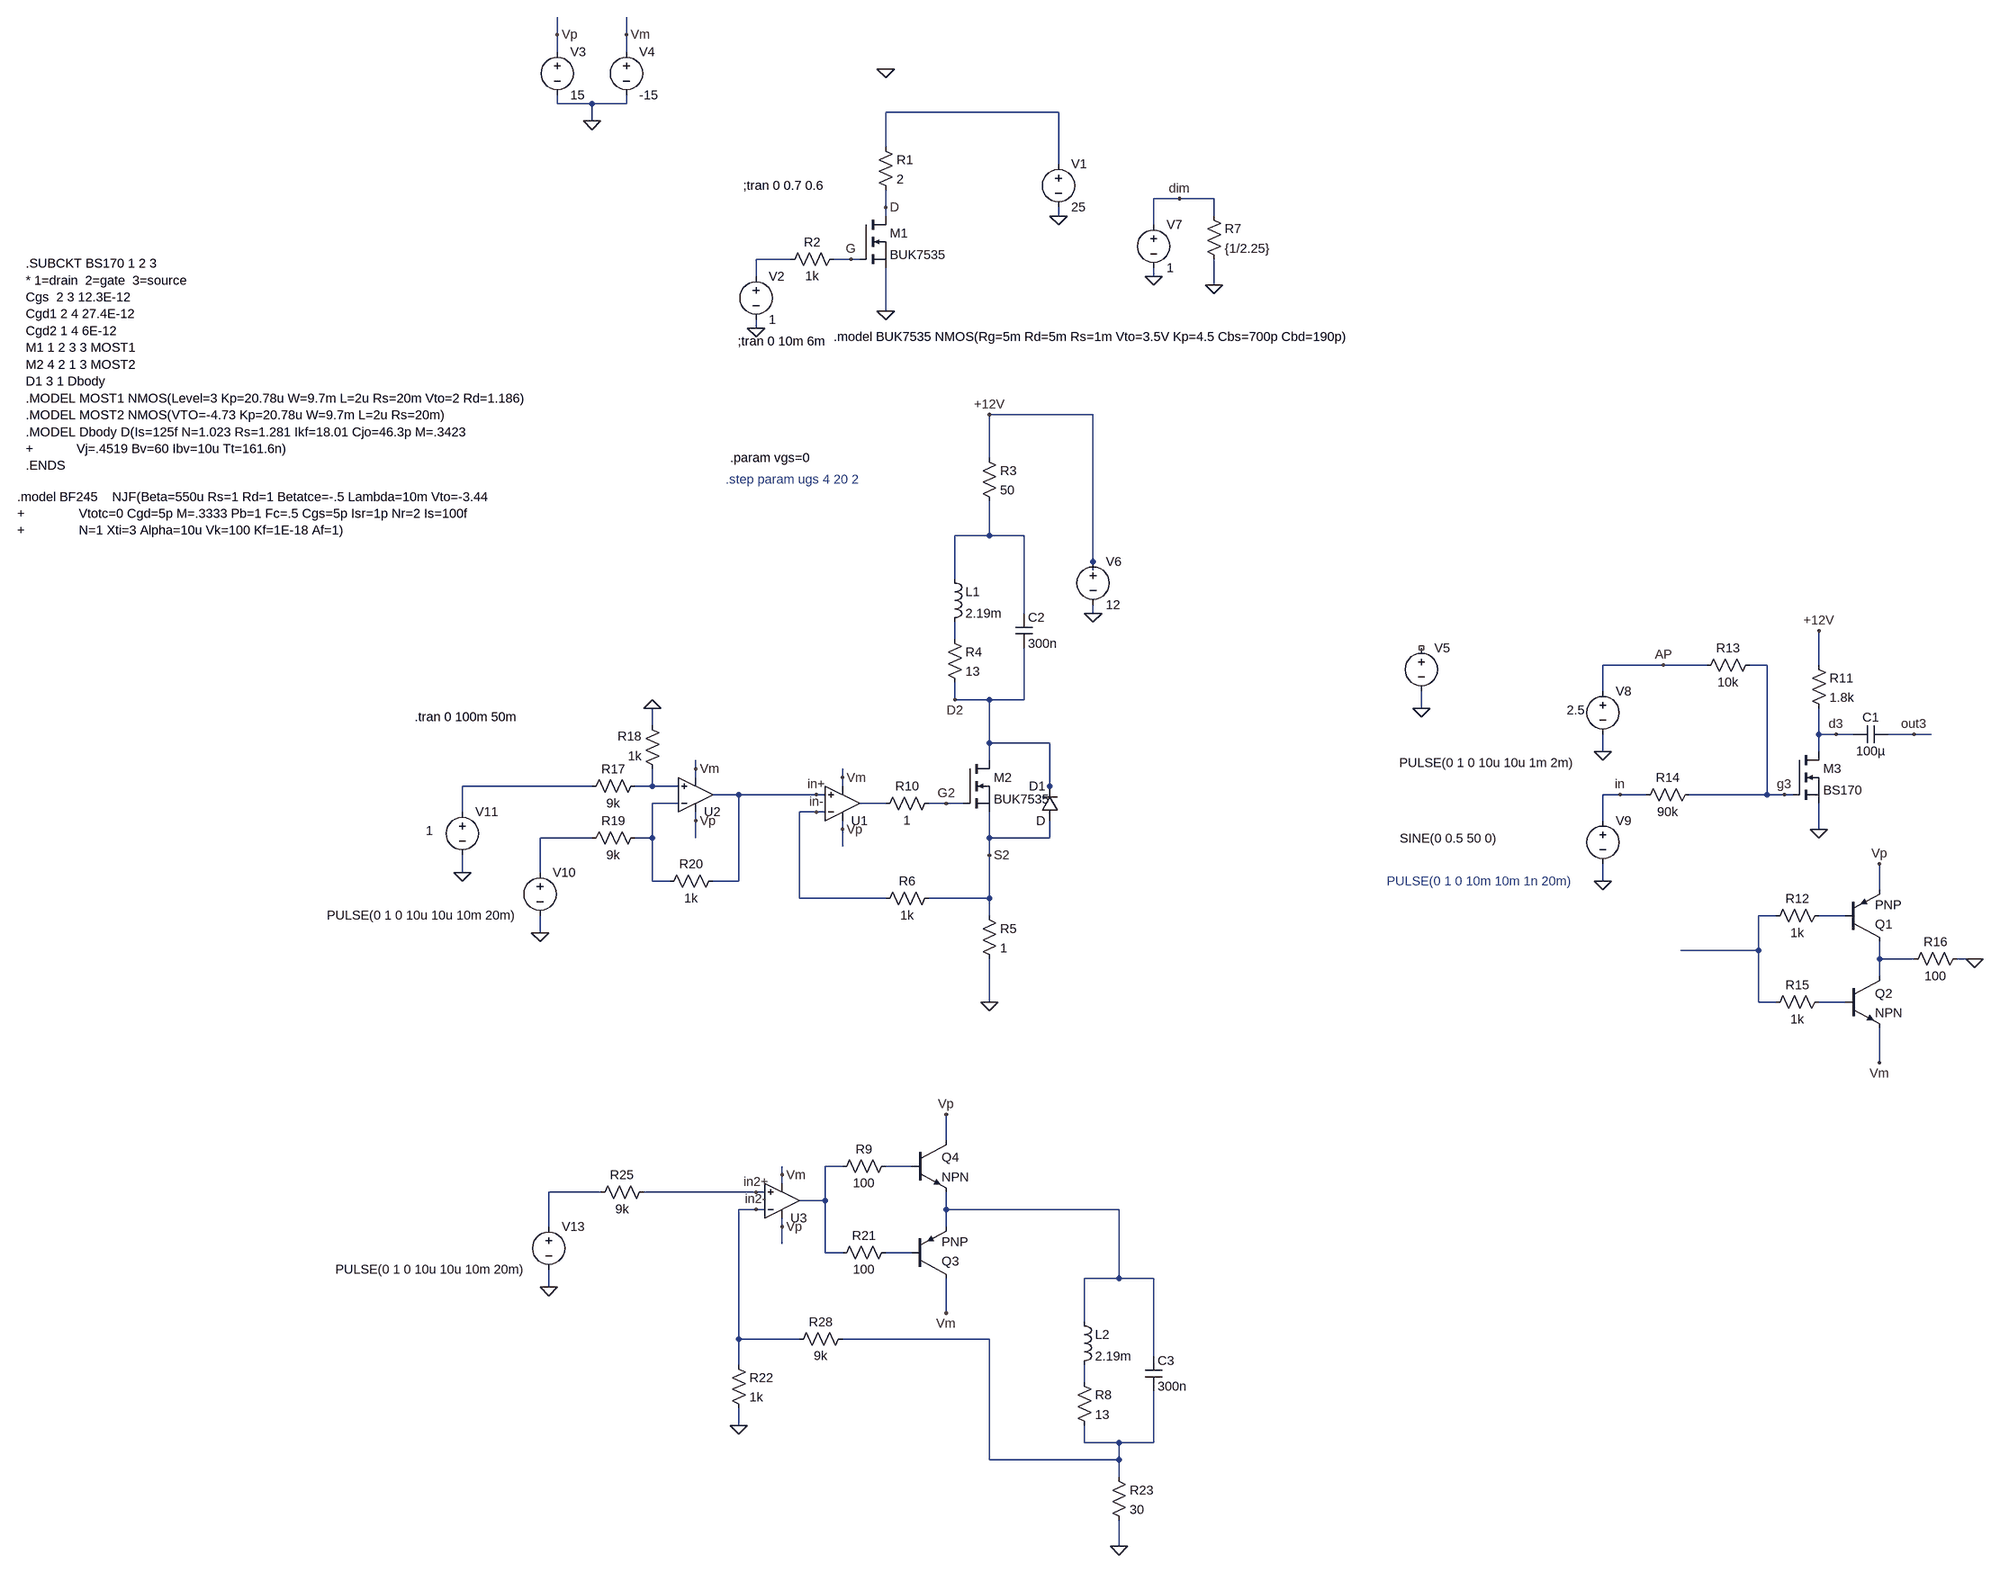
[diagram p0: schematic BUK7535_model.asc]
BUK7535_model.asc, the LTspice schematic file:
Version 4
SHEET 1 2148 2868
WIRE -496 -560 -496 -592
WIRE -368 -560 -368 -592
WIRE -496 -528 -496 -560
WIRE -368 -528 -368 -560
WIRE -496 -432 -496 -448
WIRE -432 -432 -496 -432
WIRE -368 -432 -368 -448
WIRE -368 -432 -432 -432
WIRE 432 -416 112 -416
WIRE -432 -400 -432 -432
WIRE 112 -352 112 -416
WIRE 432 -320 432 -416
WIRE 656 -256 608 -256
WIRE 720 -256 656 -256
WIRE 112 -240 112 -272
WIRE 112 -224 112 -240
WIRE 432 -224 432 -240
WIRE 720 -224 720 -256
WIRE 608 -208 608 -256
WIRE -64 -144 -128 -144
WIRE 48 -144 16 -144
WIRE 64 -144 48 -144
WIRE -128 -112 -128 -144
WIRE 608 -112 608 -128
WIRE 720 -96 720 -144
WIRE 112 -48 112 -128
WIRE -128 -16 -128 -32
WIRE 496 144 304 144
WIRE 304 224 304 144
WIRE 304 368 304 304
WIRE 304 368 240 368
WIRE 368 368 304 368
WIRE 496 416 496 144
WIRE 496 432 496 416
WIRE 240 448 240 368
WIRE 368 512 368 368
WIRE 496 512 496 496
WIRE 240 560 240 528
WIRE 1552 608 1440 608
WIRE 1632 608 1552 608
WIRE 1744 608 1712 608
WIRE 1840 608 1840 544
WIRE 1440 656 1440 608
WIRE 240 672 240 640
WIRE 304 672 240 672
WIRE 368 672 368 576
WIRE 368 672 304 672
WIRE 1104 688 1104 656
WIRE -320 720 -320 688
WIRE 1840 736 1840 688
WIRE 1872 736 1840 736
WIRE 1904 736 1872 736
WIRE 2016 736 1968 736
WIRE 2048 736 2016 736
WIRE 304 752 304 672
WIRE 416 752 304 752
WIRE 1440 768 1440 736
WIRE 1840 768 1840 736
WIRE 304 784 304 752
WIRE -240 800 -240 784
WIRE -240 816 -240 800
WIRE 32 816 32 800
WIRE -432 832 -672 832
WIRE -320 832 -320 800
WIRE -320 832 -352 832
WIRE -272 832 -320 832
WIRE 32 832 32 816
WIRE 416 832 416 752
WIRE -160 848 -208 848
WIRE -16 848 -160 848
WIRE 0 848 -16 848
WIRE 416 848 416 832
WIRE 1472 848 1440 848
WIRE 1520 848 1472 848
WIRE 1744 848 1744 608
WIRE 1744 848 1600 848
WIRE 1776 848 1744 848
WIRE 1792 848 1776 848
WIRE -272 864 -320 864
WIRE 112 864 64 864
WIRE 224 864 192 864
WIRE 256 864 224 864
WIRE -672 880 -672 832
WIRE -16 880 -48 880
WIRE 0 880 -16 880
WIRE -240 896 -240 880
WIRE 1440 896 1440 848
WIRE 32 912 32 896
WIRE 1840 912 1840 864
WIRE -432 928 -528 928
WIRE -320 928 -320 864
WIRE -320 928 -352 928
WIRE -240 928 -240 896
WIRE 304 928 304 880
WIRE 416 928 416 896
WIRE 416 928 304 928
WIRE 32 944 32 912
WIRE 304 960 304 928
WIRE -672 992 -672 960
WIRE -528 992 -528 928
WIRE -320 1008 -320 928
WIRE -288 1008 -320 1008
WIRE -160 1008 -160 848
WIRE -160 1008 -208 1008
WIRE 1440 1008 1440 976
WIRE 1952 1024 1952 976
WIRE -48 1040 -48 880
WIRE 112 1040 -48 1040
WIRE 304 1040 304 960
WIRE 304 1040 192 1040
WIRE 304 1072 304 1040
WIRE 1760 1072 1728 1072
WIRE 1888 1072 1840 1072
WIRE -528 1104 -528 1072
WIRE 1728 1136 1728 1072
WIRE 1728 1136 1584 1136
WIRE 1952 1152 1952 1120
WIRE 2016 1152 1952 1152
WIRE 2128 1152 2096 1152
WIRE 2144 1152 2128 1152
WIRE 1952 1184 1952 1152
WIRE 304 1232 304 1152
WIRE 1728 1232 1728 1136
WIRE 1760 1232 1728 1232
WIRE 1888 1232 1840 1232
WIRE 1952 1344 1952 1280
WIRE 224 1488 224 1440
WIRE 32 1536 0 1536
WIRE 160 1536 112 1536
WIRE -80 1552 -80 1536
WIRE -80 1568 -80 1552
WIRE -416 1584 -512 1584
WIRE -128 1584 -336 1584
WIRE -112 1584 -128 1584
WIRE 0 1600 0 1536
WIRE 0 1600 -48 1600
WIRE -128 1616 -160 1616
WIRE -112 1616 -128 1616
WIRE 224 1616 224 1584
WIRE 544 1616 224 1616
WIRE -512 1648 -512 1584
WIRE -80 1648 -80 1632
WIRE 224 1648 224 1616
WIRE -80 1680 -80 1648
WIRE 0 1696 0 1600
WIRE 32 1696 0 1696
WIRE 160 1696 112 1696
WIRE 544 1744 544 1616
WIRE 544 1744 480 1744
WIRE 608 1744 544 1744
WIRE -512 1760 -512 1728
WIRE 224 1808 224 1744
WIRE 480 1824 480 1744
WIRE -160 1856 -160 1616
WIRE -48 1856 -160 1856
WIRE 304 1856 32 1856
WIRE 608 1888 608 1744
WIRE -160 1904 -160 1856
WIRE 480 1936 480 1904
WIRE -160 2016 -160 1984
WIRE 480 2048 480 2016
WIRE 544 2048 480 2048
WIRE 608 2048 608 1952
WIRE 608 2048 544 2048
WIRE 304 2080 304 1856
WIRE 544 2080 544 2048
WIRE 544 2080 304 2080
WIRE 544 2112 544 2080
WIRE 544 2240 544 2192
FLAG 432 -224 0
FLAG 112 -48 0
FLAG -128 -16 0
FLAG 112 -240 D
FLAG 112 -496 0
FLAG -432 -400 0
FLAG -496 -560 Vp
FLAG -368 -560 Vm
FLAG 1104 688 0
FLAG 304 1232 0
FLAG 240 672 D2
FLAG 496 512 0
FLAG 32 912 Vp
FLAG 32 816 Vm
FLAG 48 -144 G
FLAG 608 -112 0
FLAG 720 -96 0
FLAG 656 -256 dim
FLAG 224 864 G2
FLAG 304 960 S2
FLAG -16 848 in+
FLAG -16 880 in-
FLAG 1840 912 0
FLAG 1440 768 0
FLAG 1440 1008 0
FLAG 1776 848 g3
FLAG 1872 736 d3
FLAG 2016 736 out3
FLAG 304 144 +12V
FLAG 1840 544 +12V
FLAG 1552 608 AP
FLAG 1472 848 in
FLAG 2128 1152 0
FLAG 1952 976 Vp
FLAG 1952 1344 Vm
FLAG -528 1104 0
FLAG -240 896 Vp
FLAG -240 800 Vm
FLAG -320 688 0
FLAG -672 992 0
FLAG -80 1648 Vp
FLAG -80 1552 Vm
FLAG -128 1584 in2+
FLAG -128 1616 in2-
FLAG -512 1760 0
FLAG 224 1440 Vp
FLAG 224 1808 Vm
FLAG 544 2240 0
FLAG -160 2016 0
SYMBOL nmos 64 -224 R0
SYMATTR InstName M1
SYMATTR Value BUK7535
SYMBOL res 96 -368 R0
SYMATTR InstName R1
SYMATTR Value 2
SYMBOL voltage 432 -336 R0
WINDOW 123 0 0 Left 2
WINDOW 39 0 0 Left 2
SYMATTR InstName V1
SYMATTR Value 25
SYMBOL res 32 -160 R90
WINDOW 0 0 56 VBottom 2
WINDOW 3 32 56 VTop 2
SYMATTR InstName R2
SYMATTR Value 1k
SYMBOL voltage -128 -128 R0
WINDOW 123 0 0 Left 2
WINDOW 39 0 0 Left 2
SYMATTR InstName V2
SYMATTR Value 1
SYMBOL voltage -496 -544 R0
WINDOW 123 0 0 Left 2
WINDOW 39 0 0 Left 2
SYMATTR InstName V3
SYMATTR Value 15
SYMBOL voltage -368 -544 R0
WINDOW 123 0 0 Left 2
WINDOW 39 0 0 Left 2
SYMATTR InstName V4
SYMATTR Value -15
SYMBOL voltage 1104 560 R0
WINDOW 3 -41 229 Left 2
WINDOW 123 0 0 Left 2
WINDOW 39 0 0 Left 2
SYMATTR InstName V5
SYMATTR Value PULSE(0 1 0 10u 10u 1m 2m)
SYMBOL nmos 256 784 R0
SYMATTR InstName M2
SYMATTR Value BUK7535
SYMBOL res 224 544 R0
SYMATTR InstName R4
SYMATTR Value 13
SYMBOL voltage 496 400 R0
WINDOW 123 0 0 Left 2
WINDOW 39 0 0 Left 2
SYMATTR InstName V6
SYMATTR Value 12
SYMBOL ind 224 432 R0
SYMATTR InstName L1
SYMATTR Value 2.19m
SYMBOL diode 432 896 R180
WINDOW 0 24 64 Left 2
WINDOW 3 24 0 Left 2
SYMATTR InstName D1
SYMBOL cap 352 512 R0
SYMATTR InstName C2
SYMATTR Value 300n
SYMBOL res 288 1056 R0
SYMATTR InstName R5
SYMATTR Value 1
SYMBOL res 208 1024 R90
WINDOW 0 0 56 VBottom 2
WINDOW 3 32 56 VTop 2
SYMATTR InstName R6
SYMATTR Value 1k
SYMBOL Opamps\\UniversalOpamp2 32 864 M180
SYMATTR InstName U1
SYMBOL voltage 608 -224 R0
WINDOW 123 0 0 Left 2
WINDOW 39 0 0 Left 2
SYMATTR InstName V7
SYMATTR Value 1
SYMBOL res 704 -240 R0
SYMATTR InstName R7
SYMATTR Value {1/2.25}
SYMBOL res 208 848 R90
WINDOW 0 0 56 VBottom 2
WINDOW 3 32 56 VTop 2
SYMATTR InstName R10
SYMATTR Value 1
SYMBOL nmos 1792 768 R0
SYMATTR InstName M3
SYMATTR Value BS170
SYMATTR Prefix x
SYMBOL res 1824 592 R0
SYMATTR InstName R11
SYMATTR Value 1.8k
SYMBOL res 1728 592 R90
WINDOW 0 0 56 VBottom 2
WINDOW 3 32 56 VTop 2
SYMATTR InstName R13
SYMATTR Value 10k
SYMBOL res 1616 832 R90
WINDOW 0 0 56 VBottom 2
WINDOW 3 32 56 VTop 2
SYMATTR InstName R14
SYMATTR Value 90k
SYMBOL voltage 1440 640 R0
WINDOW 3 -67 51 Left 2
WINDOW 123 0 0 Left 2
WINDOW 39 0 0 Left 2
SYMATTR InstName V8
SYMATTR Value 2.5
SYMBOL voltage 1440 880 R0
WINDOW 3 -376 49 Left 2
WINDOW 123 0 0 Left 2
WINDOW 39 0 0 Left 2
SYMATTR InstName V9
SYMATTR Value SINE(0 0.5 50 0)
SYMBOL cap 1968 720 R90
WINDOW 0 0 32 VBottom 2
WINDOW 3 32 32 VTop 2
SYMATTR InstName C1
SYMATTR Value 100µ
SYMBOL pnp 1888 1120 M180
SYMATTR InstName Q1
SYMBOL npn 1888 1184 R0
SYMATTR InstName Q2
SYMBOL res 1856 1056 R90
WINDOW 0 0 56 VBottom 2
WINDOW 3 32 56 VTop 2
SYMATTR InstName R12
SYMATTR Value 1k
SYMBOL res 1856 1216 R90
WINDOW 0 0 56 VBottom 2
WINDOW 3 32 56 VTop 2
SYMATTR InstName R15
SYMATTR Value 1k
SYMBOL res 2112 1136 R90
WINDOW 0 0 56 VBottom 2
WINDOW 3 32 56 VTop 2
SYMATTR InstName R16
SYMATTR Value 100
SYMBOL voltage -528 976 R0
WINDOW 3 -395 95 Left 2
WINDOW 123 0 0 Left 2
WINDOW 39 0 0 Left 2
SYMATTR InstName V10
SYMATTR Value PULSE(0 1 0 10u 10u 10m 20m)
SYMBOL Opamps\\UniversalOpamp2 -240 848 M180
SYMATTR InstName U2
SYMBOL res -336 816 R90
WINDOW 0 0 56 VBottom 2
WINDOW 3 32 56 VTop 2
SYMATTR InstName R17
SYMATTR Value 9k
SYMBOL res -304 816 R180
WINDOW 0 36 76 Left 2
WINDOW 3 36 40 Left 2
SYMATTR InstName R18
SYMATTR Value 1k
SYMBOL res -448 944 R270
WINDOW 0 32 56 VTop 2
WINDOW 3 0 56 VBottom 2
SYMATTR InstName R19
SYMATTR Value 9k
SYMBOL res -304 1024 R270
WINDOW 0 32 56 VTop 2
WINDOW 3 0 56 VBottom 2
SYMATTR InstName R20
SYMATTR Value 1k
SYMBOL voltage -672 864 R0
WINDOW 3 -67 51 Left 2
WINDOW 123 0 0 Left 2
WINDOW 39 0 0 Left 2
SYMATTR InstName V11
SYMATTR Value 1
SYMBOL res 288 208 R0
SYMATTR InstName R3
SYMATTR Value 50
SYMBOL res 464 1920 R0
SYMATTR InstName R8
SYMATTR Value 13
SYMBOL ind 464 1808 R0
SYMATTR InstName L2
SYMATTR Value 2.19m
SYMBOL cap 592 1888 R0
SYMATTR InstName C3
SYMATTR Value 300n
SYMBOL Opamps\\UniversalOpamp2 -80 1600 M180
SYMATTR InstName U3
SYMBOL voltage -512 1632 R0
WINDOW 3 -395 95 Left 2
WINDOW 123 0 0 Left 2
WINDOW 39 0 0 Left 2
SYMATTR InstName V13
SYMATTR Value PULSE(0 1 0 10u 10u 10m 20m)
SYMBOL res -432 1600 R270
WINDOW 0 32 56 VTop 2
WINDOW 3 0 56 VBottom 2
SYMATTR InstName R25
SYMATTR Value 9k
SYMBOL pnp 160 1744 M180
SYMATTR InstName Q3
SYMBOL npn 160 1488 R0
SYMATTR InstName Q4
SYMBOL res 128 1520 R90
WINDOW 0 0 56 VBottom 2
WINDOW 3 32 56 VTop 2
SYMATTR InstName R9
SYMATTR Value 100
SYMBOL res 128 1680 R90
WINDOW 0 0 56 VBottom 2
WINDOW 3 32 56 VTop 2
SYMATTR InstName R21
SYMATTR Value 100
SYMBOL res -176 1888 R0
SYMATTR InstName R22
SYMATTR Value 1k
SYMBOL res 48 1840 R90
WINDOW 0 0 56 VBottom 2
WINDOW 3 32 56 VTop 2
SYMATTR InstName R28
SYMATTR Value 9k
SYMBOL res 528 2096 R0
SYMATTR InstName R23
SYMATTR Value 30
TEXT -162 8 Left 2 !;tran 0 10m 6m
TEXT 16 0 Left 2 !.model BUK7535 NMOS(Rg=5m Rd=5m Rs=1m Vto=3.5V Kp=4.5 Cbs=700p Cbd=190p)
TEXT -152 -280 Left 2 !;tran 0 0.7 0.6
TEXT -176 224 Left 2 !.param vgs=0
TEXT -184 264 Left 2 ;.step param ugs 4 20 2
TEXT -1480 -136 Left 2 !.SUBCKT BS170 1 2 3\n* 1=drain  2=gate  3=source\nCgs  2 3 12.3E-12\nCgd1 2 4 27.4E-12\nCgd2 1 4 6E-12\nM1 1 2 3 3 MOST1\nM2 4 2 1 3 MOST2\nD1 3 1 Dbody\n.MODEL MOST1 NMOS(Level=3 Kp=20.78u W=9.7m L=2u Rs=20m Vto=2 Rd=1.186)\n.MODEL MOST2 NMOS(VTO=-4.73 Kp=20.78u W=9.7m L=2u Rs=20m)\n.MODEL Dbody D(Is=125f N=1.023 Rs=1.281 Ikf=18.01 Cjo=46.3p M=.3423\n+            Vj=.4519 Bv=60 Ibv=10u Tt=161.6n)\n.ENDS
TEXT -1496 296 Left 2 !.model BF245    NJF(Beta=550u Rs=1 Rd=1 Betatce=-.5 Lambda=10m Vto=-3.44\n+               Vtotc=0 Cgd=5p M=.3333 Pb=1 Fc=.5 Cgs=5p Isr=1p Nr=2 Is=100f\n+               N=1 Xti=3 Alpha=10u Vk=100 Kf=1E-18 Af=1)
TEXT 1040 1008 Left 2 ;PULSE(0 1 0 10m 10m 1n 20m)
TEXT -760 704 Left 2 !.tran 0 100m 50m

The netlist it stands for:
* BUK7535_model.asc
M1 D G 0 0 BUK7535
R1 N001 D 2
V1 N001 0 25
R2 G N002 1k
V2 N002 0 1
V3 Vp 0 15
V4 Vm 0 -15
V5 NC_01 0 PULSE(0 1 0 10u 10u 1m 2m)
M2 D2 G2 S2 S2 BUK7535
R4 N004 D2 13
V6 +12V 0 12
L1 N003 N004 2.19m
D1 S2 D2 D
C2 N003 D2 300n
R5 S2 0 1
R6 S2 in- 1k
XU1 in+ in- Vp Vm N008 level.2 Avol=1Meg GBW=10Meg Slew=10Meg ilimit=25m rail=0 Vos=0 phimargin=45 en=0 enk=0 in=0 ink=0 Rin=500Meg  ; pins IN+ IN- V+ V- OUT
V7 dim 0 1
R7 dim 0 {1/2.25}
R10 G2 N008 1
XM3 d3 g3 0 BS170  ; pins D G S
R11 +12V d3 1.8k
R13 g3 AP 10k
R14 g3 in 90k
V8 AP 0 2.5
V9 in 0 SINE(0 0.5 50 0)
C1 out3 d3 100µ
Q1 N012 N011 Vp 0 PNP
Q2 N012 N013 Vm 0 NPN
R12 N011 N010 1k
R15 N013 N010 1k
R16 0 N012 100
V10 N009 0 PULSE(0 1 0 10u 10u 10m 20m)
XU2 N006 N007 Vp Vm in+ level.2 Avol=1Meg GBW=10Meg Slew=10Meg ilimit=25m rail=0 Vos=0 phimargin=45 en=0 enk=0 in=0 ink=0 Rin=500Meg  ; pins IN+ IN- V+ V- OUT
R17 N006 N005 9k
R18 N006 0 1k
R19 N009 N007 9k
R20 N007 in+ 1k
V11 N005 0 1
R3 +12V N003 50
R8 N020 N019 13
L2 N017 N020 2.19m
C3 N017 N019 300n
XU3 in2+ in2- Vp Vm N014 level.2 Avol=1Meg GBW=10Meg Slew=10Meg ilimit=25m rail=0 Vos=0 phimargin=45 en=0 enk=0 in=0 ink=0 Rin=500Meg  ; pins IN+ IN- V+ V- OUT
V13 N016 0 PULSE(0 1 0 10u 10u 10m 20m)
R25 N016 in2+ 9k
Q3 Vm N018 N017 0 PNP
Q4 Vp N015 N017 0 NPN
R9 N015 N014 100
R21 N018 N014 100
R22 in2- 0 1k
R28 N019 in2- 9k
R23 N019 0 30
.model D D
.lib standard.dio
.model NPN NPN
.model PNP PNP
.lib standard.bjt
.model NMOS NMOS
.model PMOS PMOS
.lib standard.mos
;tran 0 10m 6m
.model BUK7535 NMOS(Rg=5m Rd=5m Rs=1m Vto=3.5V Kp=4.5 Cbs=700p Cbd=190p)
;tran 0 0.7 0.6
.param vgs=0
* .step param ugs 4 20 2
.SUBCKT BS170 1 2 3
* 1=drain  2=gate  3=source
Cgs  2 3 12.3E-12
Cgd1 2 4 27.4E-12
Cgd2 1 4 6E-12
M1 1 2 3 3 MOST1
M2 4 2 1 3 MOST2
D1 3 1 Dbody
.MODEL MOST1 NMOS(Level=3 Kp=20.78u W=9.7m L=2u Rs=20m Vto=2 Rd=1.186)
.MODEL MOST2 NMOS(VTO=-4.73 Kp=20.78u W=9.7m L=2u Rs=20m)
.MODEL Dbody D(Is=125f N=1.023 Rs=1.281 Ikf=18.01 Cjo=46.3p M=.3423
+            Vj=.4519 Bv=60 Ibv=10u Tt=161.6n)
.ENDS
.model BF245    NJF(Beta=550u Rs=1 Rd=1 Betatce=-.5 Lambda=10m Vto=-3.44
+               Vtotc=0 Cgd=5p M=.3333 Pb=1 Fc=.5 Cgs=5p Isr=1p Nr=2 Is=100f
+               N=1 Xti=3 Alpha=10u Vk=100 Kf=1E-18 Af=1)
* PULSE(0 1 0 10m 10m 1n 20m)
.tran 0 100m 50m
.lib UniversalOpamps2.sub
.backanno
.end